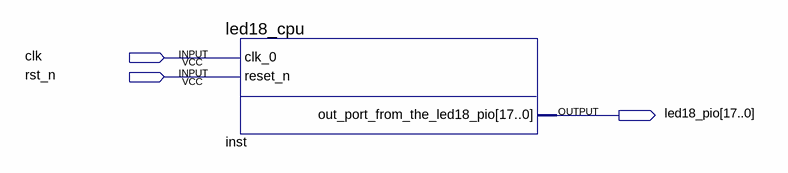
[diagram p0: schematic sheet]
// Quartus schematic led18.bdf as structural Verilog: 1 symbols, 3 pins
module led18 (
  input  clk,
  input  rst_n,
  output [17:0] led18_pio
);

  led18_cpu inst (.clk_0(clk), .reset_n(rst_n), .out_port_from_the_led18_pio(led18_pio));
endmodule
